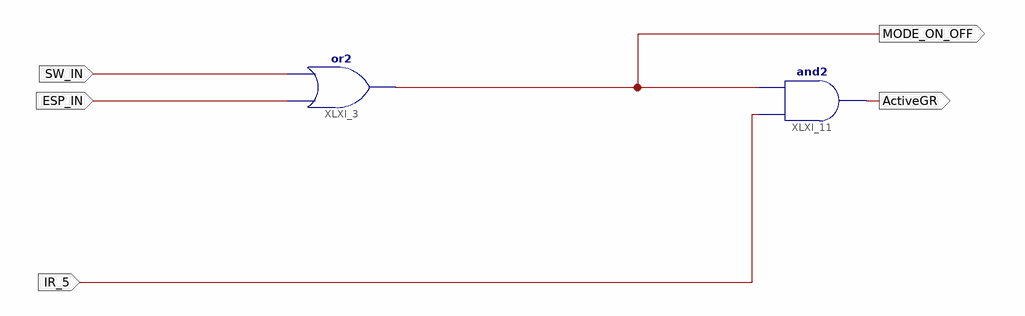
[diagram p0: schematic sheet 1]
// Xilinx ISE schematic Alarm_Garage_V6.sch (spartan6) as structural Verilog: 2 symbols, 5 ports
module Alarm_Garage_V6 (
  input  SW_IN,
  input  ESP_IN,
  input  IR_5,
  output MODE_ON_OFF,
  output ActiveGR
);

  or XLXI_3 (MODE_ON_OFF, ESP_IN, SW_IN);
  and XLXI_11 (ActiveGR, IR_5, MODE_ON_OFF);
endmodule
